# Altium schematic sheet TopLevel.SchDoc
size A4
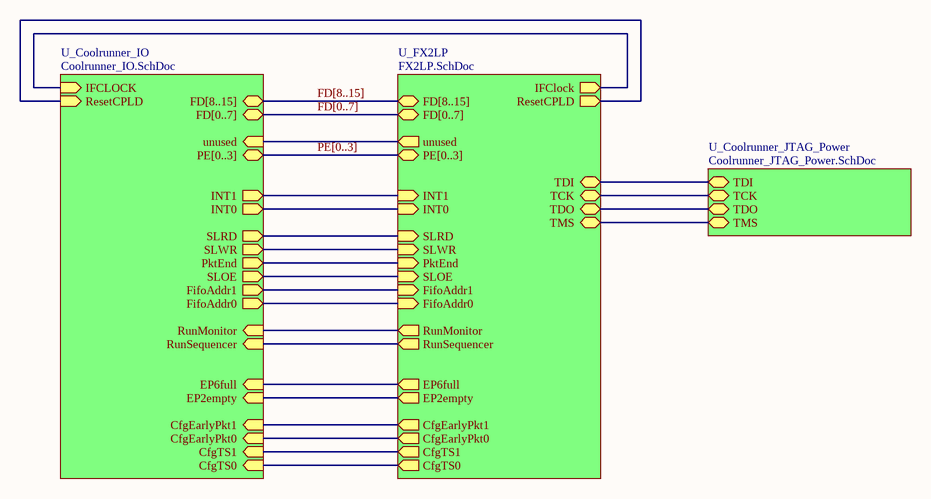
[diagram p0: TopLevel.SchDoc]

## Sub-sheets
U_Coolrunner_IO = Coolrunner_IO.SchDoc: ResetCPLD (in), IFCLOCK (in), unused (in), INT0 (out), FifoAddr0 (out), FD[8..15] (bidir), PE[0..3] (bidir), SLRD (out), SLWR (out), FD[0..7] (bidir), PktEnd (out), SLOE (out), RunMonitor (in), CfgEarlyPkt1 (in), RunSequencer (in), INT1 (out), CfgTS1 (in), CfgEarlyPkt0 (in), EP6full (in), EP2empty (in), FifoAddr1 (out), CfgTS0 (in)
U_Coolrunner_JTAG_Power = Coolrunner_JTAG_Power.SchDoc: TDI (bidir), TCK (bidir), TDO (bidir), TMS (bidir)
U_FX2LP = FX2LP.SchDoc: IFClock (out), SLRD (in), SLWR (in), unused (out), ResetCPLD (out), FD[0..7] (bidir), PE[0..3] (bidir), FD[8..15] (bidir), FifoAddr0 (in), INT0 (in), SLOE (in), PktEnd (in), EP6full (out), RunMonitor (out), CfgTS0 (out), RunSequencer (out), FifoAddr1 (in), INT1 (in), CfgEarlyPkt0 (out), CfgTS1 (out), EP2empty (out), CfgEarlyPkt1 (out), TCK (bidir), TMS (bidir), TDI (bidir), TDO (bidir)

## Nets
(unnamed): sheet U_Coolrunner_JTAG_Power/TDI, sheet U_FX2LP/TDI
(unnamed): sheet U_Coolrunner_JTAG_Power/TCK, sheet U_FX2LP/TCK
(unnamed): sheet U_Coolrunner_JTAG_Power/TDO, sheet U_FX2LP/TDO
(unnamed): sheet U_Coolrunner_JTAG_Power/TMS, sheet U_FX2LP/TMS
(unnamed): sheet U_FX2LP/IFClock, sheet U_Coolrunner_IO/IFCLOCK
(unnamed): sheet U_FX2LP/SLRD, sheet U_Coolrunner_IO/SLRD
(unnamed): sheet U_FX2LP/SLWR, sheet U_Coolrunner_IO/SLWR
(unnamed): sheet U_FX2LP/unused, sheet U_Coolrunner_IO/unused
(unnamed): sheet U_FX2LP/ResetCPLD, sheet U_Coolrunner_IO/ResetCPLD
(unnamed): sheet U_FX2LP/FifoAddr0, sheet U_Coolrunner_IO/FifoAddr0
(unnamed): sheet U_FX2LP/INT0, sheet U_Coolrunner_IO/INT0
(unnamed): sheet U_FX2LP/SLOE, sheet U_Coolrunner_IO/SLOE
(unnamed): sheet U_FX2LP/PktEnd, sheet U_Coolrunner_IO/PktEnd
(unnamed): sheet U_FX2LP/EP6full, sheet U_Coolrunner_IO/EP6full
(unnamed): sheet U_FX2LP/RunMonitor, sheet U_Coolrunner_IO/RunMonitor
(unnamed): sheet U_FX2LP/CfgTS0, sheet U_Coolrunner_IO/CfgTS0
(unnamed): sheet U_FX2LP/RunSequencer, sheet U_Coolrunner_IO/RunSequencer
(unnamed): sheet U_FX2LP/FifoAddr1, sheet U_Coolrunner_IO/FifoAddr1
(unnamed): sheet U_FX2LP/INT1, sheet U_Coolrunner_IO/INT1
(unnamed): sheet U_FX2LP/CfgEarlyPkt0, sheet U_Coolrunner_IO/CfgEarlyPkt0
(unnamed): sheet U_FX2LP/CfgTS1, sheet U_Coolrunner_IO/CfgTS1
(unnamed): sheet U_FX2LP/EP2empty, sheet U_Coolrunner_IO/EP2empty
(unnamed): sheet U_FX2LP/CfgEarlyPkt1, sheet U_Coolrunner_IO/CfgEarlyPkt1

## Buses and harness runs
bus FD[0..7] = sheet U_Coolrunner_IO/FD[0..7] = sheet U_FX2LP/FD[0..7]
bus FD[8..15] = sheet U_Coolrunner_IO/FD[8..15] = sheet U_FX2LP/FD[8..15]
bus PE[0..3] = sheet U_Coolrunner_IO/PE[0..3] = sheet U_FX2LP/PE[0..3]